# Altium schematic sheet 11_Speak.SchDoc
size A4
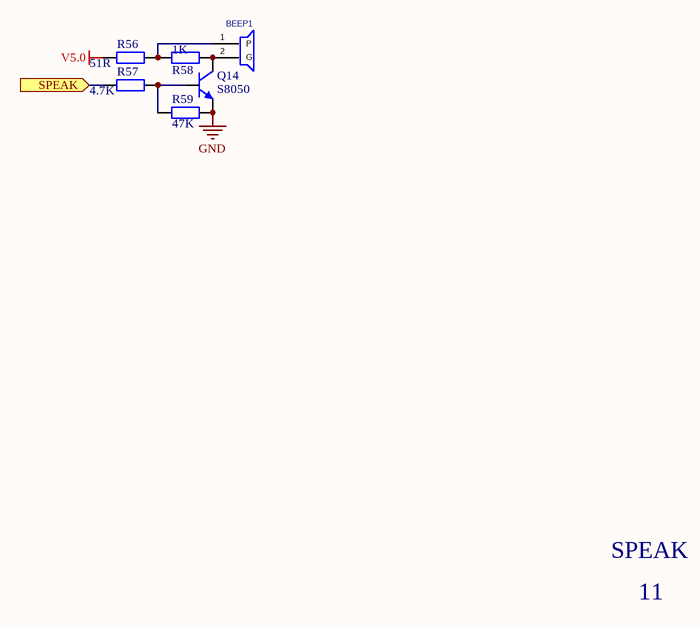
[diagram p0: 11_Speak.SchDoc]

## Parts
BEEP1  BEEP-9.5X5.5  [BEEP-9.5X5.5]  (value not drawn)
Q14  S8050  [SOT-23]
R56  51R  [SMD-0603]
R57  4.7K  [SMD-0603]
R58  1K  [SMD-0603]
R59  47K  [SMD-0603]

## Ports
SPEAK (in)

## Nets
GND: Q14.2(E) R59.2
V5.0: R56.2
SPEAK: R57.1 ; port SPEAK
NetBEEP1_1: BEEP1.1(P) R56.1 R58.2
NetBEEP1_2: BEEP1.2(G) Q14.3(C) R58.1
NetQ14_1: Q14.1(B) R57.2 R59.1

## Notes on the sheet
- SPEAK
- 11

## Library data of the parts
Q14 = NPN-1: NPN
R56-R59 = RES0: 贴片电阻 5%
BEEP1 = BEEP-9.5X5.5: PCB DECAL: BEEP-9.5X5.5